# EAGLE design mc_spine_con (EAGLE 9.4.2)
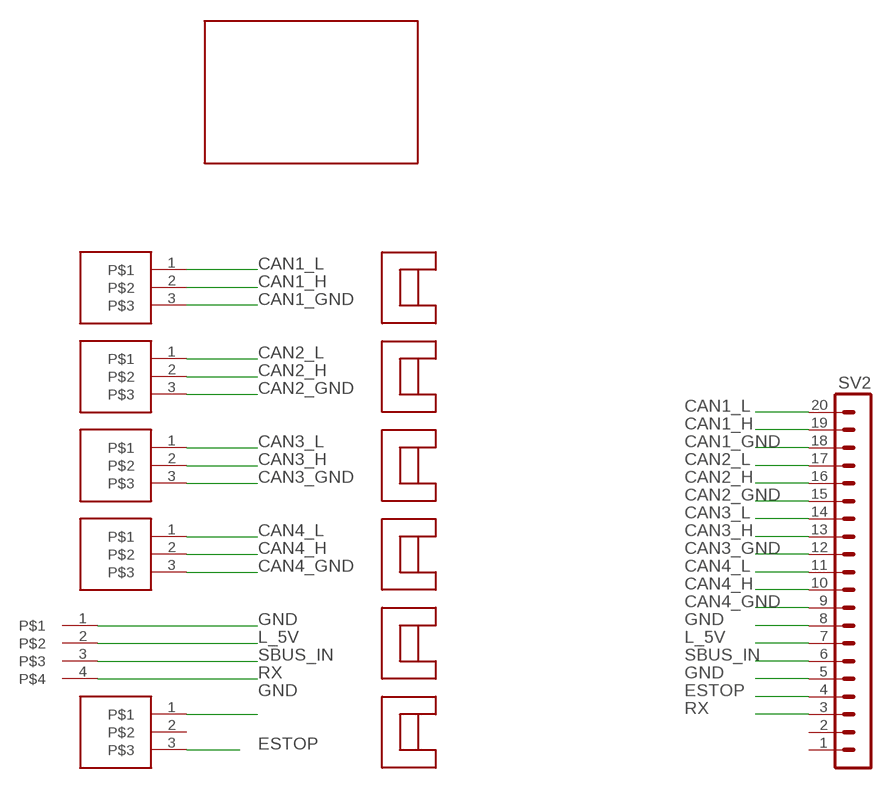
[diagram p0: schematic, sheet 1]

## Parts
SV2  MA20-1L  [MA20-1L]
U$1  3-PIN  [M80-8430342]
U$2  UP_BOARD_NOPINS  [UP_BOARD_NOPINS]
U$3  3-PIN  [M80-8430342]
U$4  3-PIN  [M80-8430342]
U$5  4-PIN  [M80-8430442]
U$6  3-PIN  [M80-8430342]
U$7  SMD_CABLE_CLIPSS8111-46R  [S8111-46R]
U$8  SMD_CABLE_CLIPSS8111-46R  [S8111-46R]
U$9  SMD_CABLE_CLIPSS8111-46R  [S8111-46R]
U$10  SMD_CABLE_CLIPSS8111-46R  [S8111-46R]
U$11  SMD_CABLE_CLIPSS8111-46R  [S8111-46R]
U$12  3-PIN  [M80-8430342]
U$13  SMD_CABLE_CLIPSS8111-46R  [S8111-46R]

## Nets
CAN1_GND: SV2.18 U$12.3
CAN1_H: SV2.19 U$12.2
CAN1_L: SV2.20 U$12.1
CAN2_GND: SV2.15 U$1.3
CAN2_H: SV2.16 U$1.2
CAN2_L: SV2.17 U$1.1
CAN3_GND: SV2.12 U$3.3
CAN3_H: SV2.13 U$3.2
CAN3_L: SV2.14 U$3.1
CAN4_GND: SV2.9 U$4.3
CAN4_H: SV2.10 U$4.2
CAN4_L: SV2.11 U$4.1
ESTOP: SV2.4 U$6.3
GND: SV2.5 SV2.8 U$5.1 U$6.1
L_5V: SV2.7 U$5.2
RX: SV2.3 U$5.4
SBUS_IN: SV2.6 U$5.3
Unconnected: SV2.1 SV2.2 U$6.2

## Library data of the parts
SV2 = con-lstb:MA20-1L: PIN HEADER; OC_FARNELL: unknown; OC_NEWARK: unknown
U$1 U$3 U$4 U$6 U$12 = Ben_Library:3-PIN
U$2 = Ben_Library:UP_BOARD_NOPINS
U$5 = Ben_Library:4-PIN
U$7-U$11 U$13 = Ben_Library:SMD_CABLE_CLIPS

## Board
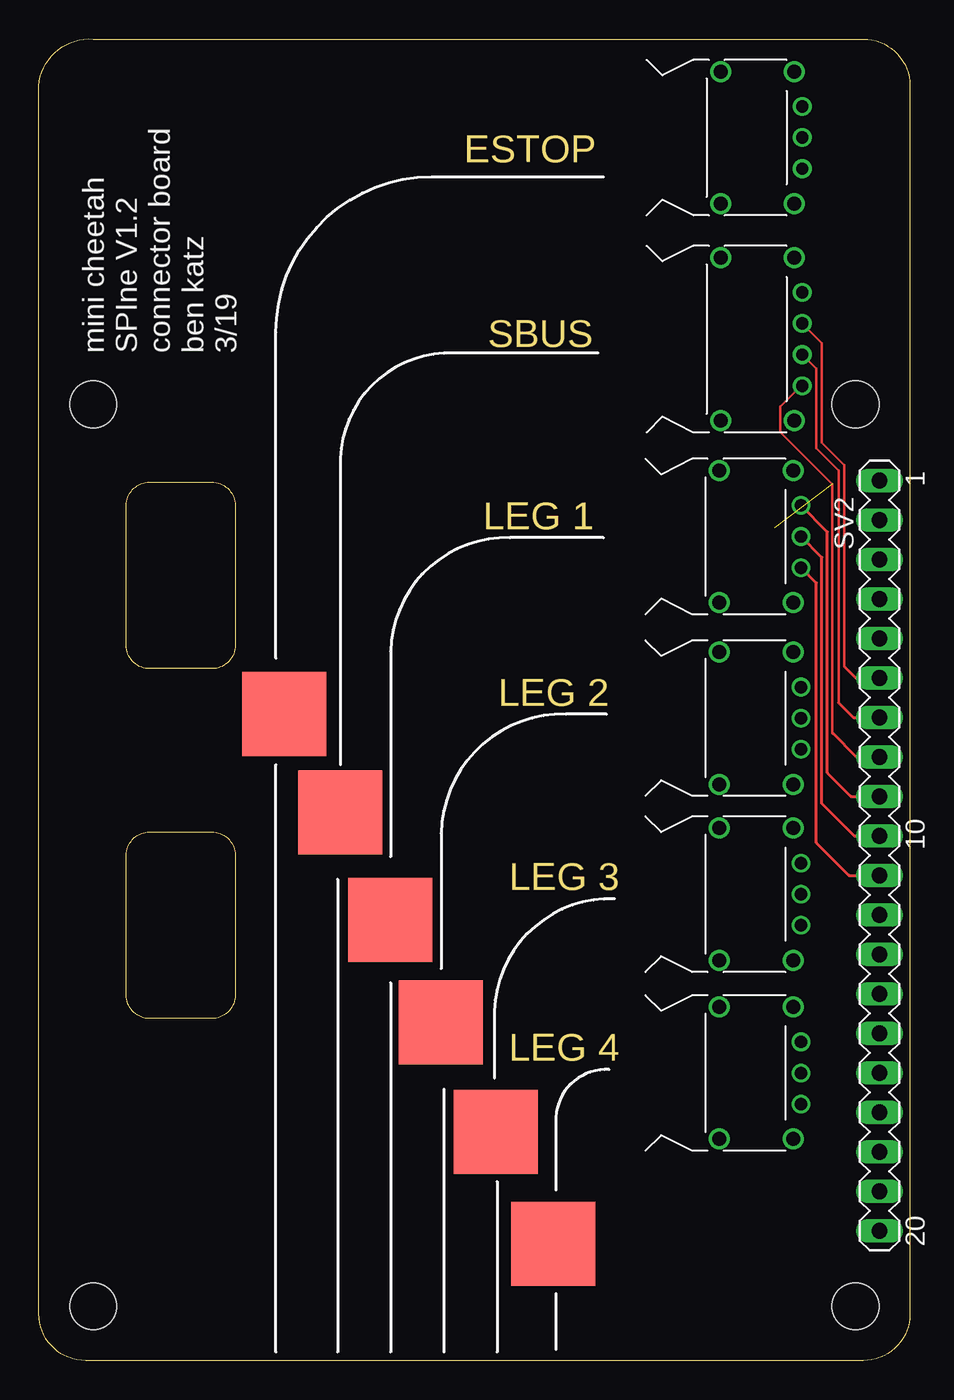
[diagram p1: board, top side]
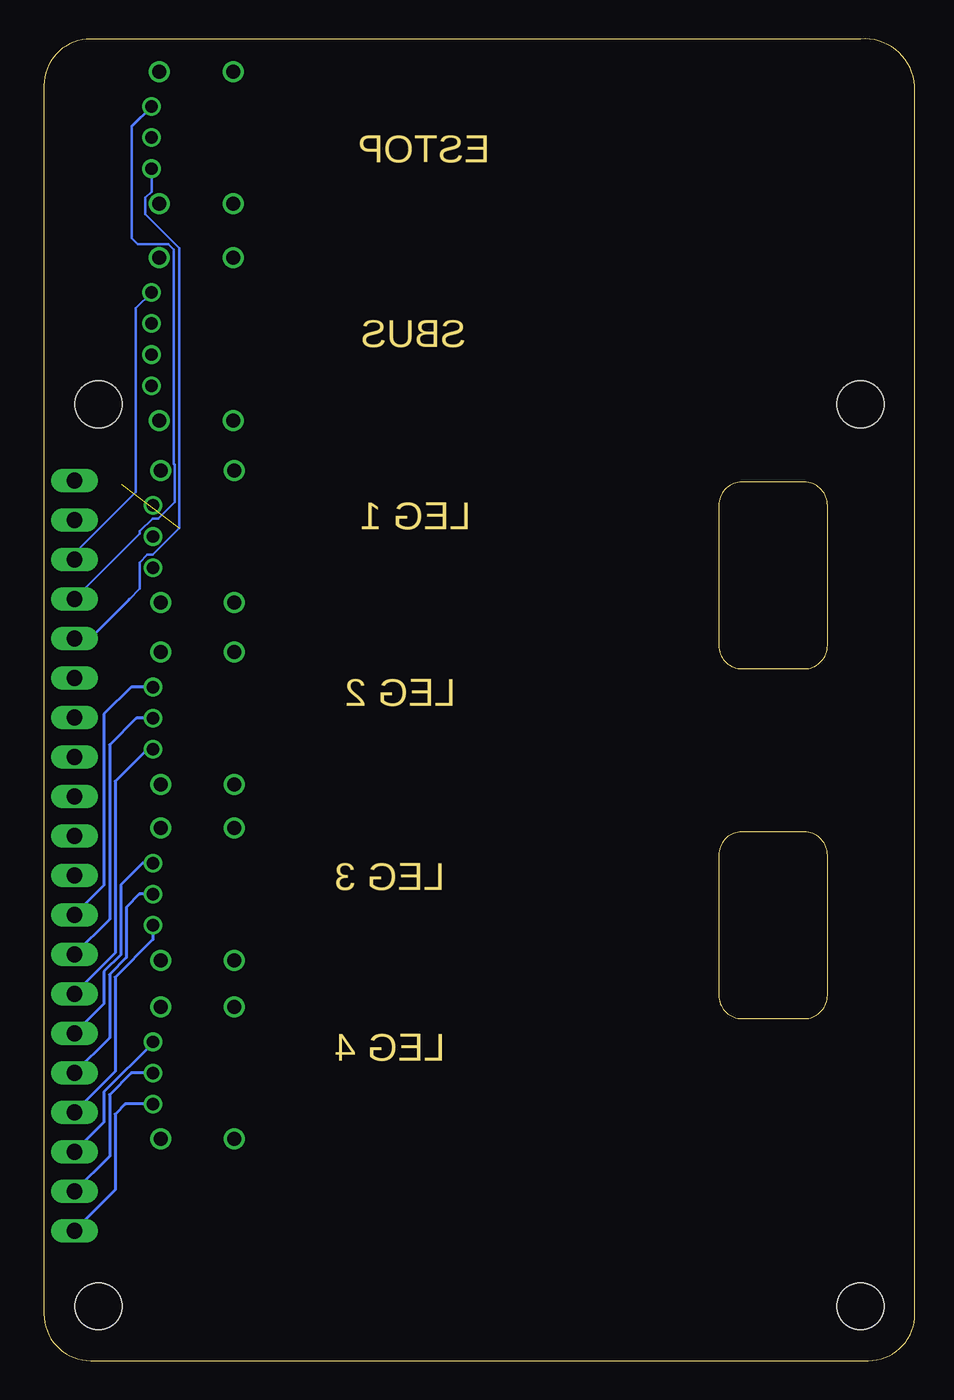
[diagram p2: board, bottom side, seen from below]

Size 56 x 85.01 mm. Coordinates in mm from the lower left corner, seen from the top.
Outline: 7.12,56.5 11.12,56.5 arc-90 12.62,55 12.62,46 arc-90 11.12,44.5 7.12,44.5 arc-90 5.62,46 5.62,55 arc-90 7.12,56.5
Outline: 7.12,34 11.12,34 arc-90 12.62,32.5 12.62,23.5 arc-90 11.12,22 7.12,22 arc-90 5.62,23.5 5.62,32.5 arc-90 7.12,34
Copper layers (1*16): Top 0.035mm / dielectric 1.5mm / Bottom 0.035mm
Design rules "default *": minimum track width 6mil, minimum drill 0.3mm, track to track 6mil, track to pad 6mil, pad to pad 6mil, via to via 6mil, smd to smd 6mil, copper to edge 40mil, drill to drill 6mil, minimum pad ring 6mil, minimum via ring 6mil, stop-mask expansion 4mil, vias tented up to drill 0mil, thermal gap 10mil

### Footprints (pad centres in the part's own frame; a part is rotated, then mirrored left to right if it is on the bottom)
MA20-1L = drill 1.016 long: 1 24.13,0; 2 21.59,0; 3 19.05,0; 4 16.51,0; 5 13.97,0; 6 11.43,0; 7 8.89,0; 8 6.35,0; 9 3.81,0; 10 1.27,0; 11 -1.27,0; 12 -3.81,0; 13 -6.35,0; 14 -8.89,0; 15 -11.43,0; 16 -13.97,0; 17 -16.51,0; 18 -19.05,0; 19 -21.59,0; 20 -24.13,0
M80-8430342 = drill 0.8: 1 2,0; 2 0,0; 3 -2,0 | drill 0.9: P$4 4.25,-0.5; P$5 -4.25,-0.5; P$6 -4.25,-5.25; P$7 4.25,-5.25
UP_BOARD_NOPINS = hole 3: 3.5,52.5; 61.5,52.5; 61.5,3.5; 3.5,3.5
M80-8430442 = drill 0.8: 1 3,0; 2 1,0; 3 -1,0; 4 -3,0 | drill 0.9: P$4 5.25,-0.5; P$5 -5.25,-0.5; P$6 -5.25,-5.25; P$7 5.25,-5.25
S8111-46R = smd 5.4 x 5.4: P$1 0,0

### Placement (x,y rotation side)
SV2  54.04,32.48 90 top
U$1  49,30 270 top
U$2  56,0 90 top
U$3  49,41.32 270 top
U$4  49,53 270 top
U$5  49.08,65.7 270 top
U$6  49.08,78.66 270 top
U$7  29.36,14.7 0 top
U$8  22.6,28.34 0 top
U$9  25.85,21.74 0 top
U$10  19.36,35.24 0 top
U$11  33.06,7.51 0 top
U$12  49,18.5 270 top
U$13  15.78,41.58 0 top

### Tracks (layer width: path | path; a pad name or v marks a point on that pad's centre or on a via)
CAN1_GND
  Bottom 0.18: U$12.3 49,20.42 52.14,17.28 52.14,15.33 SV2.18
CAN1_H
  Bottom 0.18: U$12.2 50.38,18.5 51.78,17.1 51.78,13.15 SV2.19
CAN1_L
  Bottom 0.18: U$12.1 50.76,16.5 51.42,15.84 51.42,10.97 SV2.20
CAN2_GND
  Bottom 0.18: U$1.3 49.66,32 51.06,30.6 51.06,26.1 52.14,25.02 52.14,22.95 SV2.15
CAN2_H
  Bottom 0.18: U$1.2 49.86,30 50.7,29.16 50.7,25.92 51.78,24.84 51.78,20.77 SV2.16
CAN2_L
  Bottom 0.18: U$1.1 49,27.08 51.42,24.66 51.42,18.59 SV2.17
CAN3_GND
  Bottom 0.18: U$3.3 50.4,43.32 52.14,41.58 52.14,30.57 SV2.12
CAN3_H
  Bottom 0.18: U$3.2 50.06,41.32 51.78,39.6 51.78,28.39 SV2.13
CAN3_L
  Bottom 0.18: U$3.1 49.36,39.32 51.42,37.26 51.42,26.21 SV2.14
CAN4_GND
  Top 0.18: SV2.9 52.21,36.29 50.7,37.8 50.7,53.3 U$4.3
CAN4_H
  Top 0.18: SV2.10 52.41,33.75 50.34,35.82 50.34,51.66 U$4.2
CAN4_L
  Top 0.18: SV2.11 52.07,31.21 49.98,33.3 49.98,50.02 U$4.1
ESTOP
  Bottom 0.152: 50.34,79.4 50.34,72.18 49.98,71.82 48,71.82 47.64,71.46 47.64,57.67 47.6,57.62 47.6,55.23 48.66,54.17 49,54.17 49.83,53.34 49.83,53.2 SV2.4
  Bottom 0.18: 50.34,79.4 U$6.3
GND  (1 unrouted)
  Top 0.152: U$5.1 49.01,62.7 47.68,61.36 47.68,59.72 51.02,56.38 51.02,40.36 51.06,40.32
  Top 0.18: 51.06,40.32 52.55,38.83 SV2.8
  Bottom 0.152: 50.52,48.96 49.83,49.65 49.83,51.34 49.34,51.83 49,51.83 47.29,53.54 47.29,71.54 49.48,73.73 49.48,74.78 49.08,75.19 U$6.1
  Bottom 0.18: SV2.5 53.03,46.45 50.52,48.96
L_5V
  Top 0.152: U$5.2 49.98,63.8 49.98,58.68 51.42,57.24 51.42,42.3
  Top 0.18: 51.42,42.3 52.35,41.37 SV2.7
RX
  Bottom 0.152: SV2.3 54.04,51.91 50.09,55.86 50.09,67.69 U$5.4
SBUS_IN
  Top 0.152: U$5.3 50.34,65.44 50.34,59.04 51.78,57.6 51.78,44.64
  Top 0.18: 51.78,44.64 52.51,43.91 SV2.6

### Text on the board
Dimension: ESTOP | SBUS | LEG 1 | LEG 2 | LEG 3 | LEG 4
tNames: mini cheetah / SPIne V1.2 / connector board / ben katz / 3/19